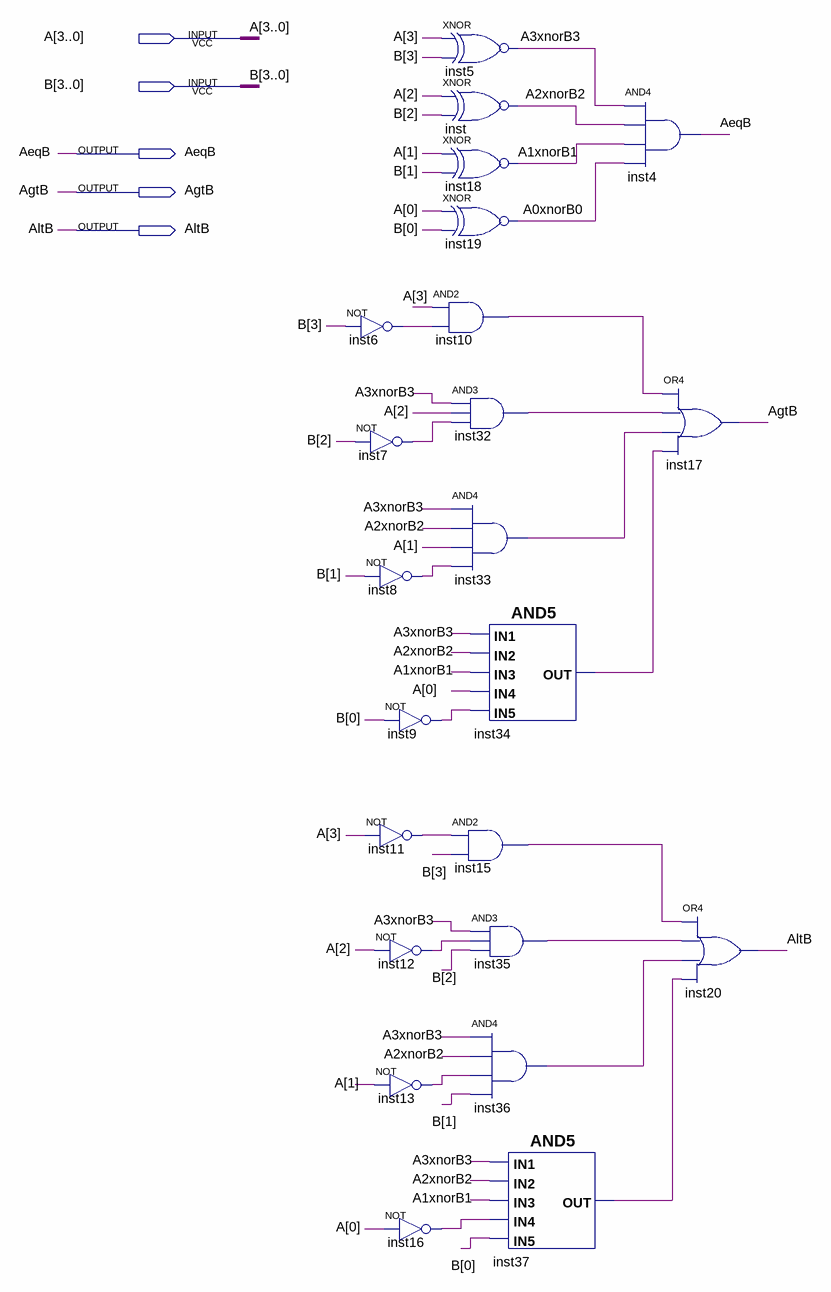
[diagram p0: schematic sheet]
// Quartus schematic comparador4bits.bdf as structural Verilog: 23 symbols, 5 pins
module comparador4bits (
  input  [3:0] A,
  input  [3:0] B,
  output AeqB,
  output AgtB,
  output AltB
);

  wire A0xnorB0, A1xnorB1, A2xnorB2, A3xnorB3, inst6_out, inst7_out, inst8_out, inst9_out, inst10_out,
       inst11_out, inst12_out, inst13_out, inst15_out, inst16_out, inst32_out, inst33_out, inst34_out,
       inst35_out, inst36_out, inst37_out;

  not inst6 (inst6_out, B[3]);
  not inst7 (inst7_out, B[2]);
  not inst8 (inst8_out, B[1]);
  not inst9 (inst9_out, B[0]);
  not inst11 (inst11_out, A[3]);
  not inst12 (inst12_out, A[2]);
  not inst13 (inst13_out, A[1]);
  not inst16 (inst16_out, A[0]);
  xnor inst5 (A3xnorB3, A[3], B[3]);
  xnor inst (A2xnorB2, A[2], B[2]);
  xnor inst18 (A1xnorB1, A[1], B[1]);
  xnor inst19 (A0xnorB0, A[0], B[0]);
  and inst10 (inst10_out, A[3], inst6_out);
  and inst32 (inst32_out, A3xnorB3, A[2], inst7_out);
  and inst33 (inst33_out, A3xnorB3, A2xnorB2, A[1], inst8_out);
  and inst15 (inst15_out, inst11_out, B[3]);
  and inst34 (inst34_out, A3xnorB3, A2xnorB2, A1xnorB1, A[0], inst9_out);
  and inst35 (inst35_out, A3xnorB3, inst12_out, B[2]);
  and inst36 (inst36_out, A3xnorB3, A2xnorB2, inst13_out, B[1]);
  and inst37 (inst37_out, A3xnorB3, A2xnorB2, A1xnorB1, inst16_out, B[0]);
  and inst4 (AeqB, A3xnorB3, A2xnorB2, A1xnorB1, A0xnorB0);
  or inst17 (AgtB, inst10_out, inst32_out, inst33_out, inst34_out);
  or inst20 (AltB, inst15_out, inst35_out, inst36_out, inst37_out);
endmodule
